# EAGLE schematic 16_Bit_Register (EAGLE 9.6.2)
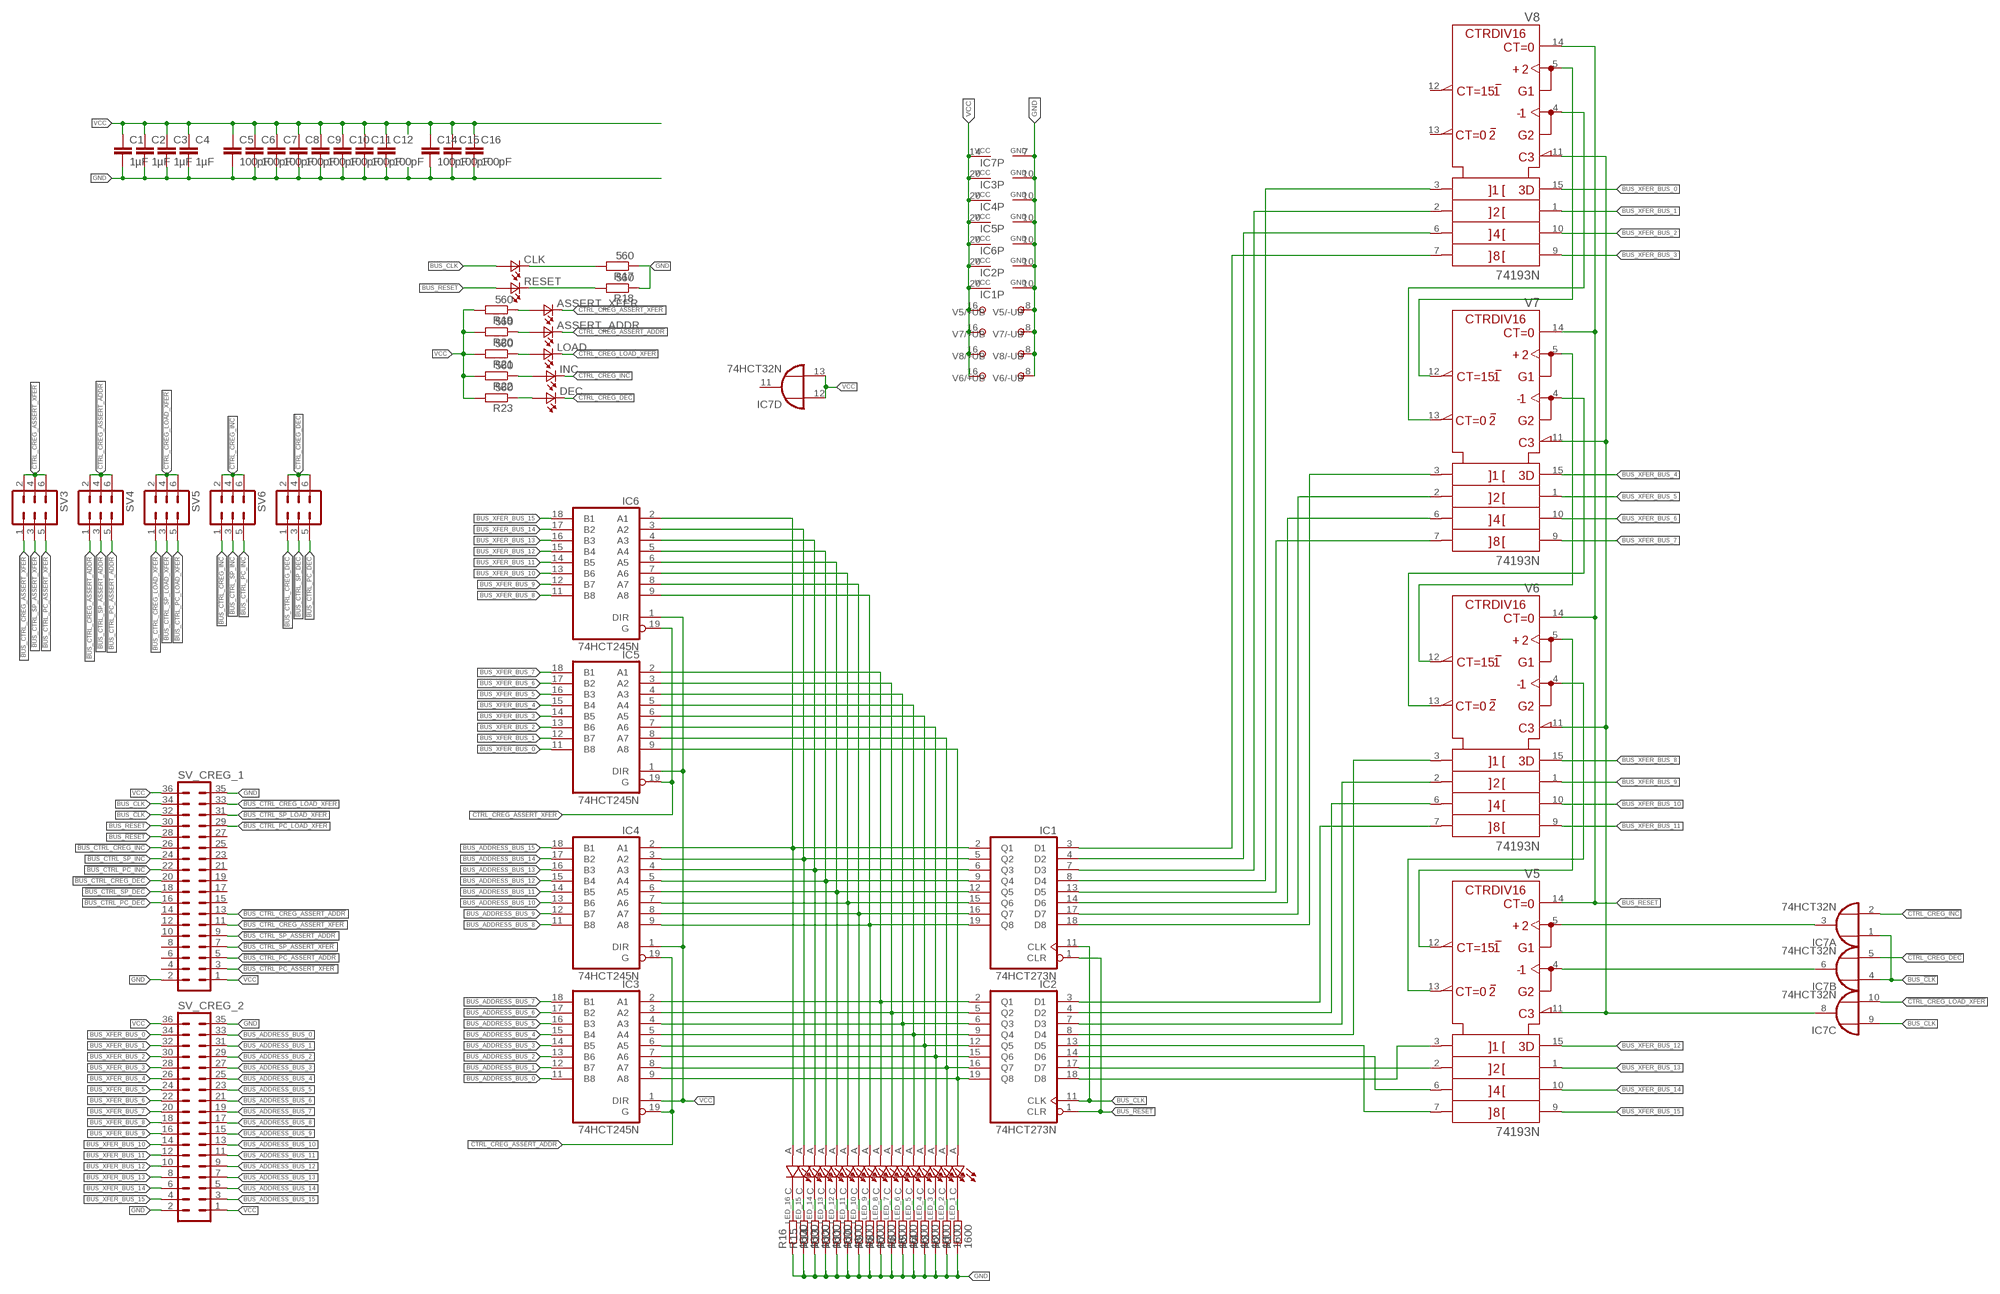
[diagram p0: schematic, sheet 1]

## Parts
ASSERT_ADDR  LTST-C193TBKT-5A  [0603]
ASSERT_XFER  LTST-C193TBKT-5A  [0603]
C1  1µF  C-EUC0805  [C0805]
C2  1µF  C-EUC0805  [C0805]
C3  1µF  C-EUC0805  [C0805]
C4  1µF  C-EUC0805  [C0805]
C5  100pF  C-EUC0805  [C0805]
C6  100pF  C-EUC0805  [C0805]
C7  100pF  C-EUC0805  [C0805]
C8  100pF  C-EUC0805  [C0805]
C9  100pF  C-EUC0805  [C0805]
C10  100pF  C-EUC0805  [C0805]
C11  100pF  C-EUC0805  [C0805]
C12  100pF  C-EUC0805  [C0805]
C14  100pF  C-EUC0805  [C0805]
C15  100pF  C-EUC0805  [C0805]
C16  100pF  C-EUC0805  [C0805]
CLK  LTST-C193TBKT-5A  [0603]
DEC  LTST-C193TBKT-5A  [0603]
IC1  74HCT273N  [DIL20]
IC2  74HCT273N  [DIL20]
IC3  74HCT245N  [DIL20]
IC4  74HCT245N  [DIL20]
IC5  74HCT245N  [DIL20]
IC6  74HCT245N  [DIL20]
IC7  74HCT32N  [DIL14]
INC  LTST-C193TBKT-5A  [0603]
LED_1  LTST-C193KRKT-5A  [LEDC1608X45N]
LED_2  LTST-C193KRKT-5A  [LEDC1608X45N]
LED_3  LTST-C193KRKT-5A  [LEDC1608X45N]
LED_4  LTST-C193KRKT-5A  [LEDC1608X45N]
LED_5  LTST-C193KRKT-5A  [LEDC1608X45N]
LED_6  LTST-C193KRKT-5A  [LEDC1608X45N]
LED_7  LTST-C193KRKT-5A  [LEDC1608X45N]
LED_8  LTST-C193KRKT-5A  [LEDC1608X45N]
LED_9  LTST-C193KRKT-5A  [LEDC1608X45N]
LED_10  LTST-C193KRKT-5A  [LEDC1608X45N]
LED_11  LTST-C193KRKT-5A  [LEDC1608X45N]
LED_12  LTST-C193KRKT-5A  [LEDC1608X45N]
LED_13  LTST-C193KRKT-5A  [LEDC1608X45N]
LED_14  LTST-C193KRKT-5A  [LEDC1608X45N]
LED_15  LTST-C193KRKT-5A  [LEDC1608X45N]
LED_16  LTST-C193KRKT-5A  [LEDC1608X45N]
LOAD  LTST-C193TBKT-5A  [0603]
R1  1600  R-EU_R0805  [R0805]
R2  1600  R-EU_R0805  [R0805]
R3  1600  R-EU_R0805  [R0805]
R4  1600  R-EU_R0805  [R0805]
R5  1600  R-EU_R0805  [R0805]
R6  1600  R-EU_R0805  [R0805]
R7  1600  R-EU_R0805  [R0805]
R8  1600  R-EU_R0805  [R0805]
R9  1600  R-EU_R0805  [R0805]
R10  1600  R-EU_R0805  [R0805]
R11  1600  R-EU_R0805  [R0805]
R12  1600  R-EU_R0805  [R0805]
R13  1600  R-EU_R0805  [R0805]
R14  1600  R-EU_R0805  [R0805]
R15  1600  R-EU_R0805  [R0805]
R16  1600  R-EU_R0805  [R0805]
R17  560  R-EU_R0805  [R0805]
R18  560  R-EU_R0805  [R0805]
R19  560  R-EU_R0805  [R0805]
R20  560  R-EU_R0805  [R0805]
R21  560  R-EU_R0805  [R0805]
R22  560  R-EU_R0805  [R0805]
R23  560  R-EU_R0805  [R0805]
RESET  LTST-C193TBKT-5A  [0603]
SV3  MA03-2  [MA03-2]
SV4  MA03-2  [MA03-2]
SV5  MA03-2  [MA03-2]
SV6  MA03-2  [MA03-2]
SV7  MA03-2  [MA03-2]
SV_CREG_1  MA18-2  [MA18-2]
SV_CREG_2  MA18-2  [MA18-2]
V5  74193N  [DIL16]
V6  74193N  [DIL16]
V7  74193N  [DIL16]
V8  74193N  [DIL16]

## Nets
!BUS_CTRL_CREG_ASSERT_ADDR: SV4.1 SV_CREG_1.13
!BUS_CTRL_CREG_ASSERT_XFER: SV3.1 SV_CREG_1.11
!BUS_CTRL_CREG_DEC: SV7.1 SV_CREG_1.20
!BUS_CTRL_CREG_INC: SV6.1 SV_CREG_1.26
!BUS_CTRL_CREG_LOAD_XFER: SV5.1 SV_CREG_1.33
!BUS_CTRL_PC_ASSERT_ADDR: SV4.5 SV_CREG_1.5
!BUS_CTRL_PC_ASSERT_XFER: SV3.5 SV_CREG_1.3
!BUS_CTRL_PC_DEC: SV7.5 SV_CREG_1.16
!BUS_CTRL_PC_INC: SV6.5 SV_CREG_1.22
!BUS_CTRL_PC_LOAD_XFER: SV5.5 SV_CREG_1.29
!BUS_CTRL_SP_ASSERT_ADDR: SV4.3 SV_CREG_1.9
!BUS_CTRL_SP_ASSERT_XFER: SV3.3 SV_CREG_1.7
!BUS_CTRL_SP_DEC: SV7.3 SV_CREG_1.18
!BUS_CTRL_SP_INC: SV6.3 SV_CREG_1.24
!BUS_CTRL_SP_LOAD_XFER: SV5.3 SV_CREG_1.31
!CTRL_CREG_ASSERT_ADDR: ASSERT_ADDR.1(K2) IC3.19(G) IC4.19(G) SV4.2 SV4.4 SV4.6
!CTRL_CREG_ASSERT_XFER: ASSERT_XFER.1(K2) IC5.19(G) IC6.19(G) SV3.2 SV3.4 SV3.6
!CTRL_CREG_DEC: DEC.1(K2) IC7.5(B:I1) SV7.2 SV7.4 SV7.6
!CTRL_CREG_INC: IC7.2(A:I1) INC.1(K2) SV6.2 SV6.4 SV6.6
!CTRL_CREG_LOAD_XFER: IC7.10(C:I1) LOAD.1(K2) SV5.2 SV5.4 SV5.6
BUS_!CLK: IC7.1(A:I0) IC7.4(B:I0) SV_CREG_1.32
BUS_!RESET: IC1.1(CLR) IC2.1(CLR) SV_CREG_1.28
BUS_ADDRESS_BUS_0: IC3.11(B8) SV_CREG_2.33
BUS_ADDRESS_BUS_1: IC3.12(B7) SV_CREG_2.31
BUS_ADDRESS_BUS_2: IC3.13(B6) SV_CREG_2.29
BUS_ADDRESS_BUS_3: IC3.14(B5) SV_CREG_2.27
BUS_ADDRESS_BUS_4: IC3.15(B4) SV_CREG_2.25
BUS_ADDRESS_BUS_5: IC3.16(B3) SV_CREG_2.23
BUS_ADDRESS_BUS_6: IC3.17(B2) SV_CREG_2.21
BUS_ADDRESS_BUS_7: IC3.18(B1) SV_CREG_2.19
BUS_ADDRESS_BUS_8: IC4.11(B8) SV_CREG_2.17
BUS_ADDRESS_BUS_9: IC4.12(B7) SV_CREG_2.15
BUS_ADDRESS_BUS_10: IC4.13(B6) SV_CREG_2.13
BUS_ADDRESS_BUS_11: IC4.14(B5) SV_CREG_2.11
BUS_ADDRESS_BUS_12: IC4.15(B4) SV_CREG_2.9
BUS_ADDRESS_BUS_13: IC4.16(B3) SV_CREG_2.7
BUS_ADDRESS_BUS_14: IC4.17(B2) SV_CREG_2.5
BUS_ADDRESS_BUS_15: IC4.18(B1) SV_CREG_2.3
BUS_CLK: CLK.2(A2) IC1.11(CLK) IC2.11(CLK) IC7.9(C:I0) SV_CREG_1.34
BUS_RESET: RESET.2(A2) SV_CREG_1.30 V5.14(CLR) V6.14(CLR) V7.14(CLR) V8.14(CLR)
BUS_XFER_BUS_0: IC5.11(B8) SV_CREG_2.34 V8.15(A)
BUS_XFER_BUS_1: IC5.12(B7) SV_CREG_2.32 V8.1(B)
BUS_XFER_BUS_2: IC5.13(B6) SV_CREG_2.30 V8.10(C)
BUS_XFER_BUS_3: IC5.14(B5) SV_CREG_2.28 V8.9(D)
BUS_XFER_BUS_4: IC5.15(B4) SV_CREG_2.26 V7.15(A)
BUS_XFER_BUS_5: IC5.16(B3) SV_CREG_2.24 V7.1(B)
BUS_XFER_BUS_6: IC5.17(B2) SV_CREG_2.22 V7.10(C)
BUS_XFER_BUS_7: IC5.18(B1) SV_CREG_2.20 V7.9(D)
BUS_XFER_BUS_8: IC6.11(B8) SV_CREG_2.18 V6.15(A)
BUS_XFER_BUS_9: IC6.12(B7) SV_CREG_2.16 V6.1(B)
BUS_XFER_BUS_10: IC6.13(B6) SV_CREG_2.14 V6.10(C)
BUS_XFER_BUS_11: IC6.14(B5) SV_CREG_2.12 V6.9(D)
BUS_XFER_BUS_12: IC6.15(B4) SV_CREG_2.10 V5.15(A)
BUS_XFER_BUS_13: IC6.16(B3) SV_CREG_2.8 V5.1(B)
BUS_XFER_BUS_14: IC6.17(B2) SV_CREG_2.6 V5.10(C)
BUS_XFER_BUS_15: IC6.18(B1) SV_CREG_2.4 V5.9(D)
GND: C1.2 C2.2 C3.2 C4.2 C5.2 C6.2 C7.2 C8.2 C9.2 C10.2 C11.2 C12.2 C14.2 C15.2 C16.2 IC1.10(GND) IC2.10(GND) IC3.10(GND) IC4.10(GND) IC5.10(GND) IC6.10(GND) IC7.7(P:GND) R1.1 R2.1 R3.1 R4.1 R5.1 R6.1 R7.1 R8.1 R9.1 R10.1 R11.1 R12.1 R13.1 R14.1 R15.1 R16.1 R17.1 R18.1 SV_CREG_1.2 SV_CREG_1.35 SV_CREG_2.2 SV_CREG_2.35 V5.8(-UB) V6.8(-UB) V7.8(-UB) V8.8(-UB)
N$1: IC2.19(Q8) IC3.9(A8) IC5.9(A8) LED_1.A
N$2: IC2.16(Q7) IC3.8(A7) IC5.8(A7) LED_2.A
N$3: IC2.15(Q6) IC3.7(A6) IC5.7(A6) LED_3.A
N$4: IC2.12(Q5) IC3.6(A5) IC5.6(A5) LED_4.A
N$5: IC2.9(Q4) IC3.5(A4) IC5.5(A4) LED_5.A
N$6: IC2.6(Q3) IC3.4(A3) IC5.4(A3) LED_6.A
N$7: IC2.5(Q2) IC3.3(A2) IC5.3(A2) LED_7.A
N$8: IC2.2(Q1) IC3.2(A1) IC5.2(A1) LED_8.A
N$9: IC1.19(Q8) IC4.9(A8) IC6.9(A8) LED_9.A
N$10: IC1.16(Q7) IC4.8(A7) IC6.8(A7) LED_10.A
N$11: IC1.15(Q6) IC4.7(A6) IC6.7(A6) LED_11.A
N$12: IC1.12(Q5) IC4.6(A5) IC6.6(A5) LED_12.A
N$13: IC1.9(Q4) IC4.5(A4) IC6.5(A4) LED_13.A
N$14: IC1.6(Q3) IC4.4(A3) IC6.4(A3) LED_14.A
N$15: IC1.5(Q2) IC4.3(A2) IC6.3(A2) LED_15.A
N$16: IC1.2(Q1) IC4.2(A1) IC6.2(A1) LED_16.A
N$17: LOAD.2(A2) R21.1
N$18: ASSERT_ADDR.2(A2) R20.1
N$19: LED_1.C R1.2
N$20: ASSERT_XFER.2(A2) R19.1
N$21: IC2.18(D8) V5.3(QA)
N$22: IC2.17(D7) V5.2(QB)
N$23: IC2.14(D6) V5.6(QC)
N$24: IC2.13(D5) V5.7(QD)
N$25: IC2.8(D4) V6.3(QA)
N$26: IC2.7(D3) V6.2(QB)
N$27: IC2.4(D2) V6.6(QC)
N$28: IC2.3(D1) V6.7(QD)
N$29: IC1.18(D8) V7.3(QA)
N$30: IC1.17(D7) V7.2(QB)
N$31: IC1.14(D6) V7.6(QC)
N$32: IC1.13(D5) V7.7(QD)
N$33: IC1.8(D4) V8.3(QA)
N$34: IC1.7(D3) V8.2(QB)
N$35: IC1.4(D2) V8.6(QC)
N$36: IC1.3(D1) V8.7(QD)
N$37: V5.12(!CO) V6.5(UP)
N$38: V5.13(!BO) V6.4(DOWN)
N$39: V6.12(!CO) V7.5(UP)
N$40: V6.13(!BO) V7.4(DOWN)
N$41: V7.12(!CO) V8.5(UP)
N$42: V7.13(!BO) V8.4(DOWN)
N$43: IC7.6(B:O) V5.4(DOWN)
N$44: IC7.8(C:O) V5.11(!LOAD) V6.11(!LOAD) V7.11(!LOAD) V8.11(!LOAD)
N$45: IC7.3(A:O) V5.5(UP)
N$50: DEC.2(A2) R23.1
N$51: INC.2(A2) R22.1
N$54: LED_2.C R2.2
N$55: LED_3.C R3.2
N$56: LED_4.C R4.2
N$57: LED_5.C R5.2
N$58: LED_6.C R6.2
N$59: LED_7.C R7.2
N$66: LED_8.C R8.2
N$67: LED_9.C R9.2
N$68: LED_10.C R10.2
N$69: LED_11.C R11.2
N$70: LED_12.C R12.2
N$71: LED_13.C R13.2
N$72: LED_14.C R14.2
N$73: CLK.1(K2) R17.2
N$74: R18.2 RESET.1(K2)
N$80: LED_15.C R15.2
N$86: LED_16.C R16.2
VCC: C1.1 C2.1 C3.1 C4.1 C5.1 C6.1 C7.1 C8.1 C9.1 C10.1 C11.1 C12.1 C14.1 C15.1 C16.1 IC1.20(VCC) IC2.20(VCC) IC3.1(DIR) IC3.20(VCC) IC4.1(DIR) IC4.20(VCC) IC5.1(DIR) IC5.20(VCC) IC6.1(DIR) IC6.20(VCC) IC7.12(D:I0) IC7.13(D:I1) IC7.14(P:VCC) R19.2 R20.2 R21.2 R22.2 R23.2 SV_CREG_1.1 SV_CREG_1.36 SV_CREG_2.1 SV_CREG_2.36 V5.16(+UB) V6.16(+UB) V7.16(+UB) V8.16(+UB)
Unconnected: IC7.11(D:O) SV_CREG_1.4 SV_CREG_1.6 SV_CREG_1.8 SV_CREG_1.10 SV_CREG_1.12 SV_CREG_1.14 SV_CREG_1.15 SV_CREG_1.17 SV_CREG_1.19 SV_CREG_1.21 SV_CREG_1.23 SV_CREG_1.25 SV_CREG_1.27 V8.12(!CO) V8.13(!BO)

## Library data of the parts
ASSERT_ADDR ASSERT_XFER CLK DEC INC LOAD RESET = Dargon's_lib:LTST-C193TBKT-5A: http://octopart.com/ltst-c190tbkt-lite-on-550003
C1-C12 C14-C16 = rcl:C-EU: CAPACITOR, European symbol; SPICEPREFIX: C
IC1 IC2 = 74xx-eu:74*273: Octal D type FLIP FLOP, clear
IC3-IC6 = 74xx-eu:74*245: Octal BUS TRANSCEIVER, 3-state
IC7 = 74xx-eu:74*32: Quad 2-input OR gate
LED_1-LED_16 = Dargon's_lib:LTST-C193KRKT-5A: Red 631nm LED Indication - Discrete 2V 0603 (1608 Metric); MANUFACTURER: Lite-On; MAXIMUM_PACKAGE_HEIGHT: 0.45 mm; PARTREV: C; STANDARD: IPC 7351B
R1-R23 = rcl:R-EU_: RESISTOR, European symbol; SPICEPREFIX: R
SV3-SV7 = con-lstb:MA03-2: PIN HEADER; OC_FARNELL: unknown; OC_NEWARK: unknown
SV_CREG_1 SV_CREG_2 = con-lstb:MA18-2: PIN HEADER; OC_FARNELL: unknown; OC_NEWARK: unknown
V5-V8 = 74ttl-din:74*193: Synchronus 4-bit up down COUNTER